# EAGLE design TopBoardLidar (EAGLE 9.4.2)
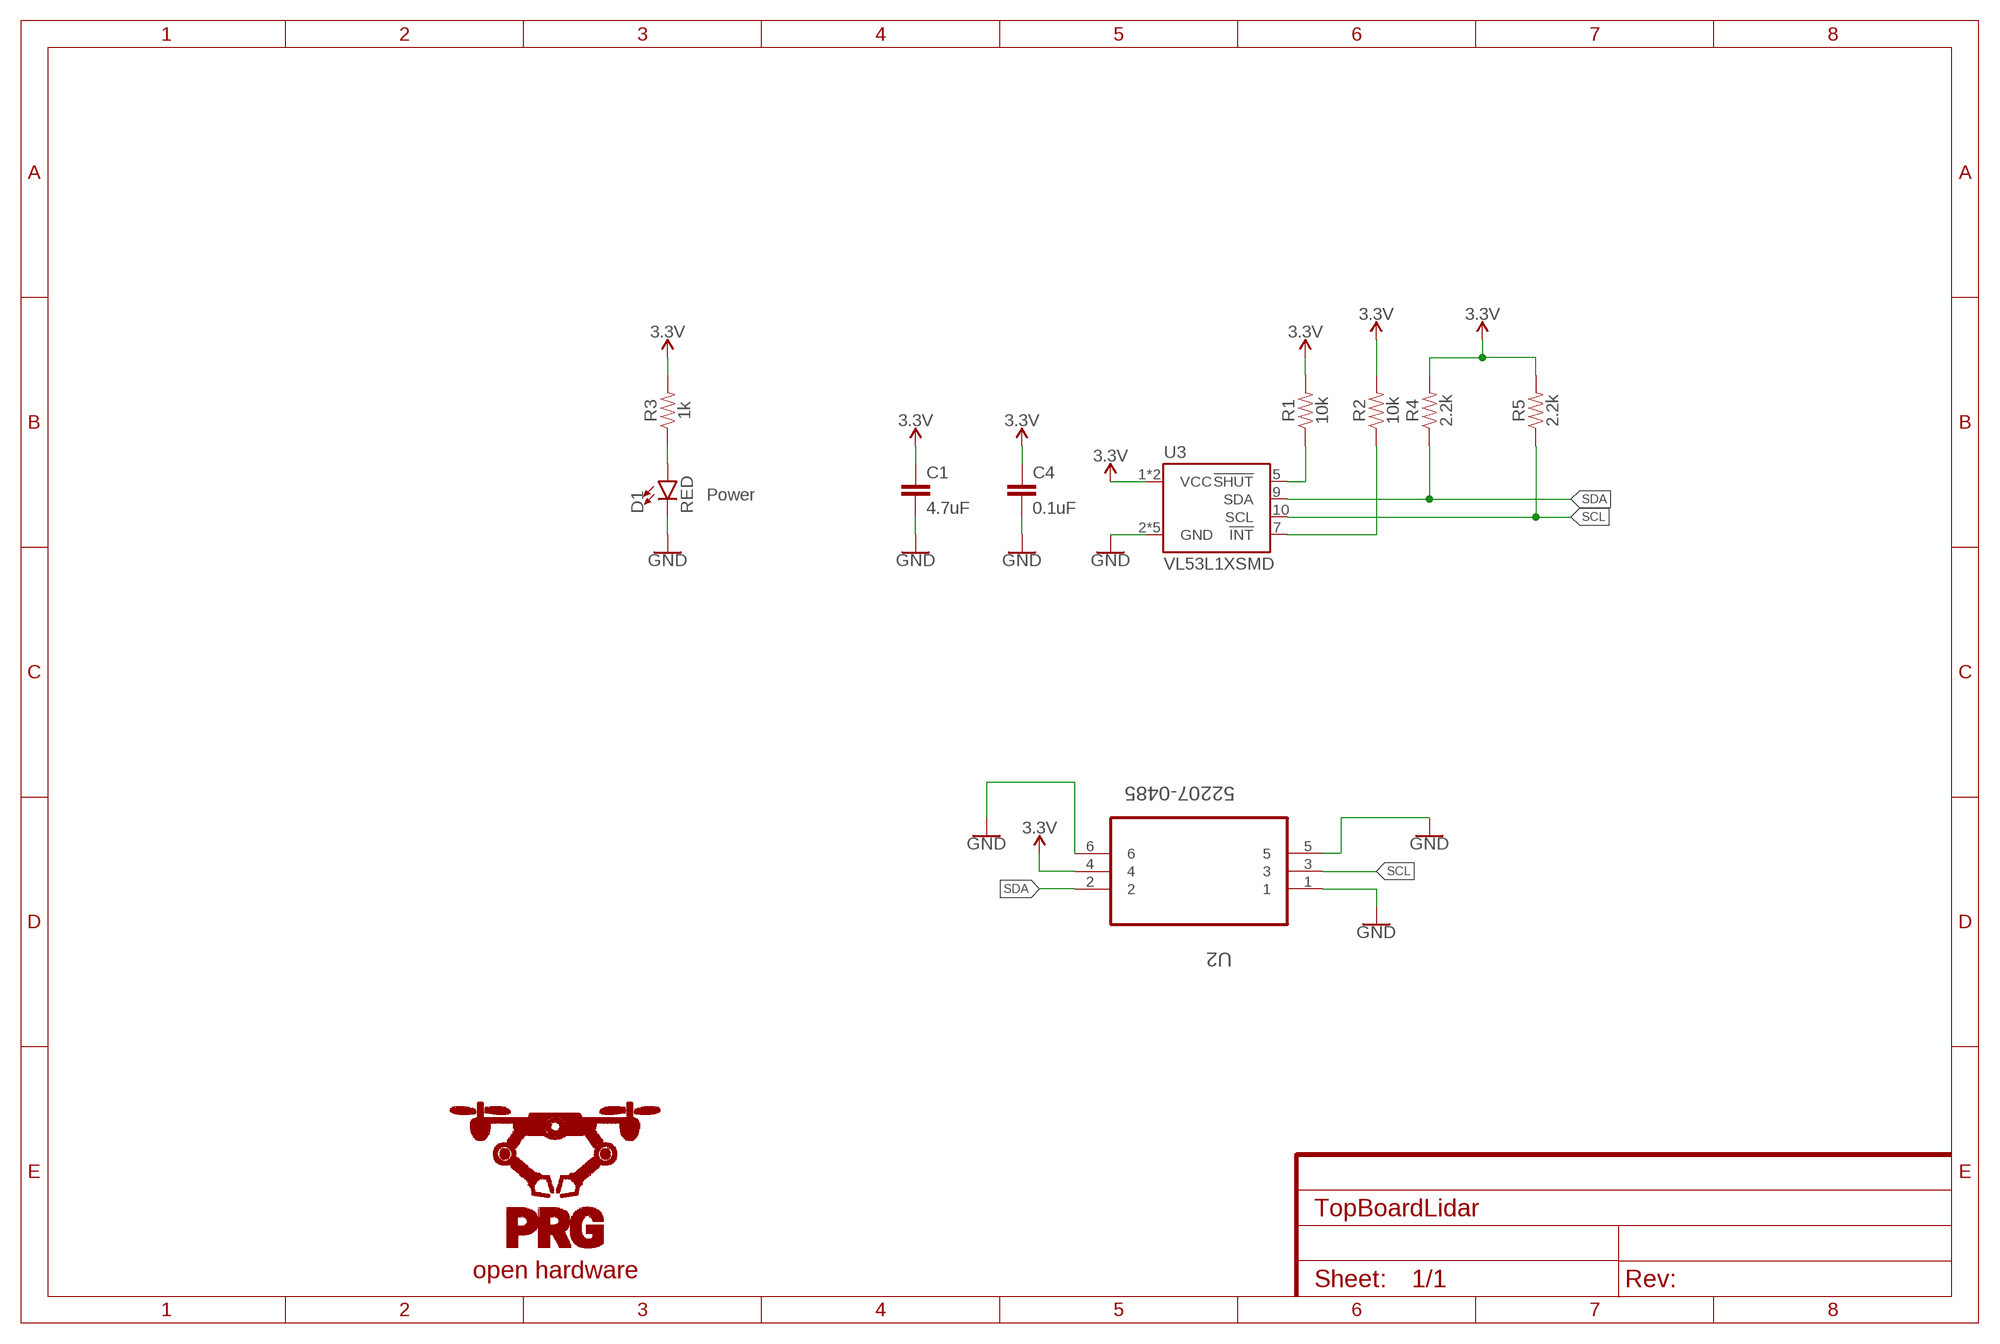
[diagram p0: schematic, sheet 1]

## Parts
C1  4.7uF  4.7UF0603  [0603]
C4  0.1uF  0.1UF-0603-25V-(+80/-20%)  [0603]
D1  RED  LED-RED0603  [LED-0603]
R1  10k  10KOHM-0603-1/10W-1%  [0603]
R2  10k  10KOHM-0603-1/10W-1%  [0603]
R3  1k  1KOHM-0603-1/10W-1%  [0603]
R4  2.2k  2.2KOHM-0402T-1/16W-1%  [0402-TIGHT]
R5  2.2k  2.2KOHM-0402T-1/16W-1%  [0402-TIGHT]
U2  52207-0485  [MOLEX_52207-0485]
U3  VL53L1XSMD  [VL53L1X]

## Nets
3.3V: C1.1 C4.1 R1.2 R2.2 R3.2 R4.2 R5.2 U2.4 U3.1(VCC) U3.11(VCC)
GND: C1.2 C4.2 D1.C U2.1 U2.5 U2.6 U3.2(GND) U3.3(GND) U3.4(GND) U3.6(GND) U3.12(GND)
N$1: R1.1 U3.5(!SHUT)
N$3: D1.A R3.1
N$8: R2.1 U3.7(!INT)
SCL: R5.1 U2.3 U3.10(SCL)
SDA: R4.1 U2.2 U3.9(SDA)

## Notes on the sheet
- Power
- open hardware

## Library data of the parts
C1 = SparkFun-Capacitors:4.7UF: 4.7µF ceramic capacitors A capacitor is a passive two-terminal electrical component used to store electrical energy temporarily in an electric field.; PROD_ID: CAP-08280
C4 = SparkFun-Capacitors:0.1UF: 0.1µF ceramic capacitors A capacitor is a passive two-terminal electrical component used to store electrical energy temporarily in an electric field.; PROD_ID: CAP-00810
D1 = SparkFun-LED:LED-RED: Red SMD LED Used in manufacturing of most products at SparkFun Packages: 0603 - SMD 0603 package [Product Link] <http://docs.avagotech.com/docs/AV02-0551EN> 0603 SMART - SMD 0603 SMART package ( more efficient and expensive)[Product Link] <http://www.osram-os.com/Graphics/XPic2/00077099_0.pdf> 1206 - SMD1206 package [Product Link] <https://www.sparkfun.com/datasheets/DevTools/LilyPad/Q150OVS4.pdff> SparkFun Products: Pro Mini 328 -5V <https://www.sparkfun.com/products/821> RedBoard <https://www.sparkfun.com/products/12757> IOIO-OTG <https://www.sparkfun.com/products/13613>; PROD_ID: DIO-00819
R1 R2 = SparkFun-Resistors:10KOHM: 10kΩ resistor A resistor is a passive two-terminal electrical component that implements electrical resistance as a circuit element. Resistors act to reduce current flow, and, at the same time, act to lower voltage levels within circuits. - Wikipedia; PROD_ID: RES-00824
R3 = SparkFun-Resistors:1KOHM: 1kΩ resistor A resistor is a passive two-terminal electrical component that implements electrical resistance as a circuit element. Resistors act to reduce current flow, and, at the same time, act to lower voltage levels within circuits. - Wikipedia; PROD_ID: RES-07856
R4 R5 = SparkFun-Resistors:2.2KOHM: 2.2kΩ resistor A resistor is a passive two-terminal electrical component that implements electrical resistance as a circuit element. Resistors act to reduce current flow, and, at the same time, act to lower voltage levels within circuits. - Wikipedia; PROD_ID: RES-14341
U2 = Molex_By_element14_Batch_1:52207-0485: SOCKET FPC, SMT, 1MM, 4 WAY; MPN: 52207-0485; OC_FARNELL: 1463013; OC_NEWARK: 58J9499; PACKAGE: SOCKET FPC, SMT, 1MM, 4 WAY; SUPPLIER: Molex
U3 = vl53l1x:VL53L1X

## Board
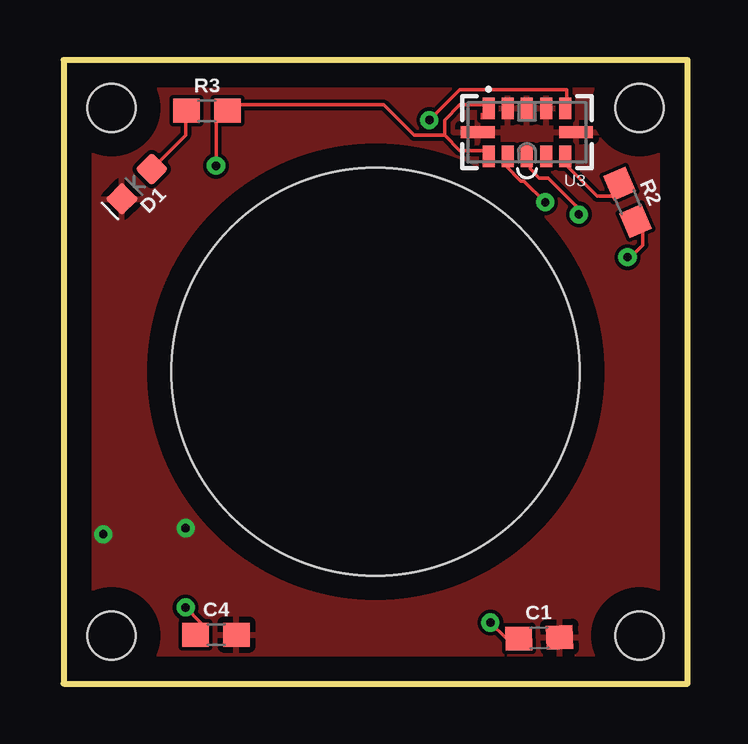
[diagram p1: board, top side]
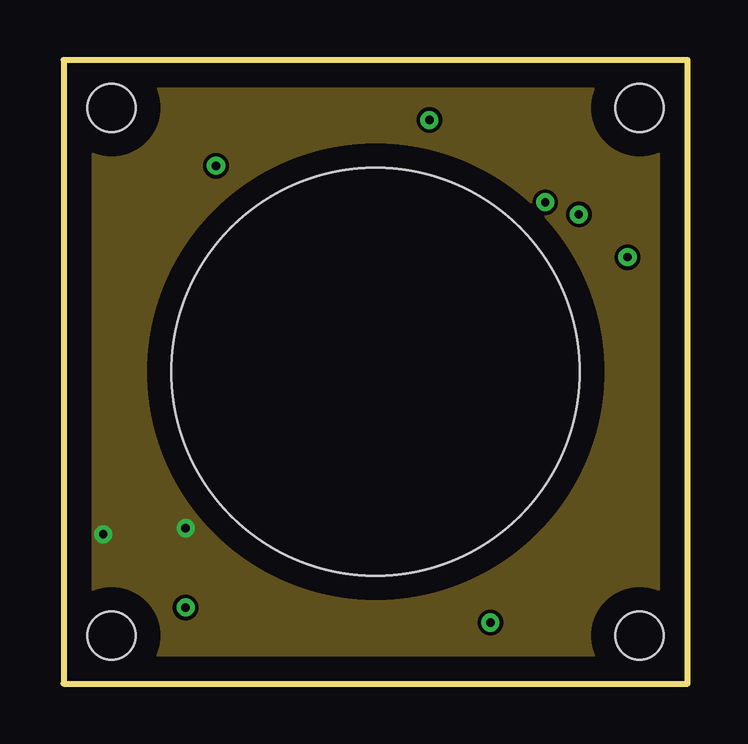
[diagram p2: board, inner layer Route2]
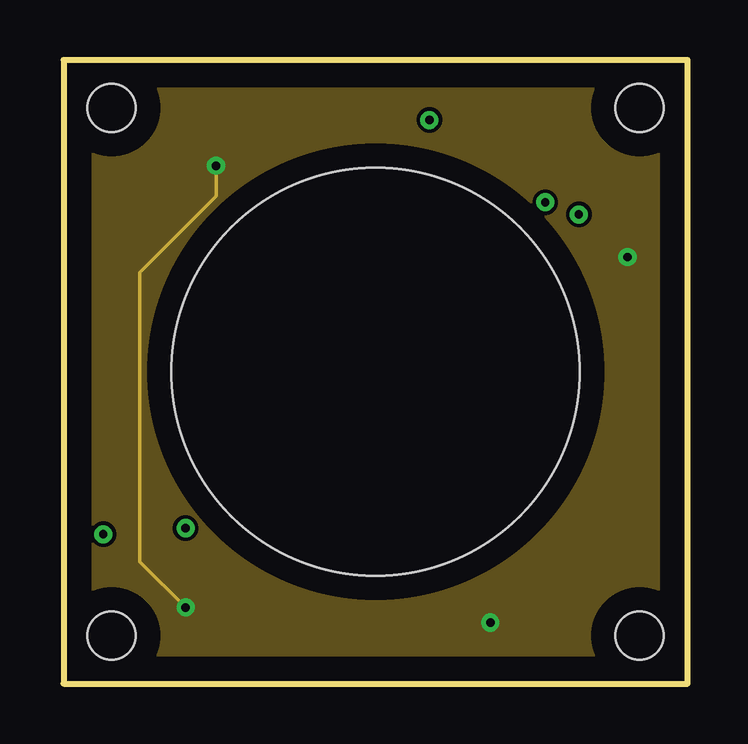
[diagram p3: board, inner layer Route15]
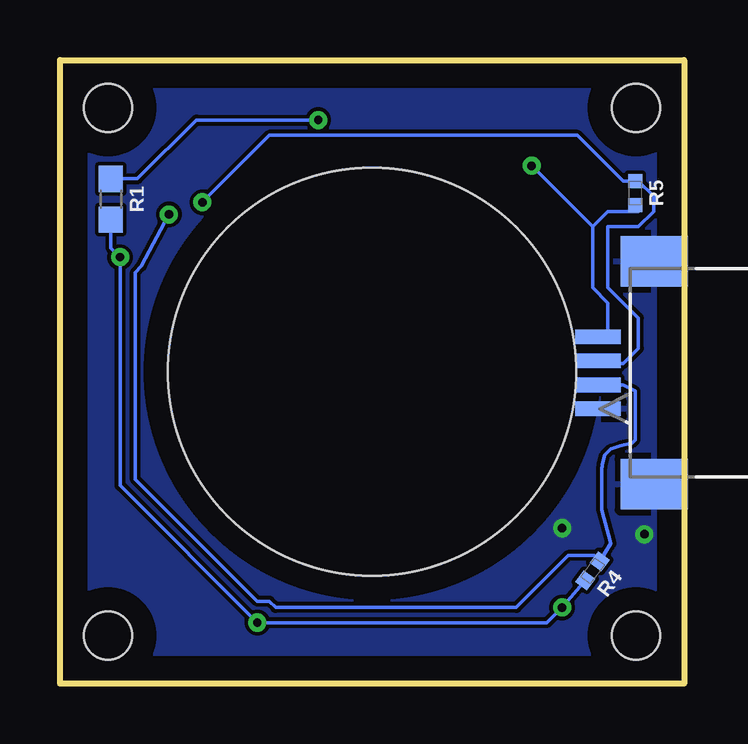
[diagram p4: board, bottom side, seen from below]

Size 26 x 26 mm. Coordinates in mm from the lower left corner, seen from the top.
Outline: 0,26 0,0 26,0 26,26 0,26
Copper layers (1+2*15+16): Top 0.035mm / dielectric 0.18mm / Route2 0.017mm / dielectric 1.12mm / Route15 0.017mm / dielectric 0.18mm / Bottom 0.035mm
Design rules "default *": minimum track width 6mil, minimum drill 0.35mm, track to track 6mil, track to pad 6mil, pad to pad 6mil, via to via 6mil, smd to smd 6mil, copper to edge 40mil, drill to drill 6mil, minimum pad ring 10mil, minimum via ring 8mil, stop-mask expansion 4mil, vias tented up to drill 0mil, thermal gap 10mil
Holes 17 mm at 13,13
Holes 2 mm at 24,2 24,24 2,24 2,2

### Footprints (pad centres in the part's own frame; a part is rotated, then mirrored left to right if it is on the bottom)
0603 = smd 1.1 x 1: 1 -0.85,0; 2 0.85,0
LED-0603 = smd 1 x 1: A -0.877,0; C 0.877,0
0402-TIGHT = smd 0.6 x 0.6: 1 -0.5,0; 2 0.5,0
MOLEX_52207-0485 = smd 0.61 x 1.905: 1 1.499,4.801; 2 0.508,4.801; 3 -0.508,4.801; 4 -1.499,4.801 | smd 2.108 x 2.794: 5 -4.648,7.137; 6 4.648,7.137
VL53L1X = smd 0.5 x 0.9: 1 1.6,-1; 2 0.8,-1; 3 0,-1; 4 -0.8,-1; 5 -1.6,-1; 7 -1.6,1; 8 -0.8,1; 9 0,1; 10 0.8,1; 11 1.6,1 | smd 1.4 x 0.5: 6 -2.05,0; 12 2.05,0

### Placement (x,y rotation side)
C1  19.81,1.91 1.8 top
C4  6.35,2.03 0 top
D1  3.05,20.83 225 top
R1  23.88,20.19 270 bottom
R2  23.5,20.07 293.2 top
R3  5.97,23.88 0 top
R4  3.81,4.7 233.2 bottom
R5  2.03,20.45 270 bottom
U2  8.38,12.95 270 bottom
U3  19.3,22.99 180 top

### Tracks (layer width: path | path; a pad name or v marks a point on that pad's centre or on a via)
3.3V  (via drill 0.35)
  Top 0.152: 15.88,22.86 16.51,22.23 17.78,22.23 U3.11 | 15.88,22.86 15.88,23.5 16.51,24.13 17.58,24.13 17.57,24.12 U3.1 | v6.35,21.59 6.35,23.5 R3.2 6.99,24.13 13.34,24.13 14.61,22.86 15.88,22.86 | v5.08,3.17 5.71,2.54 5.71,1.91 C4.1 | v17.78,2.54 18.41,1.91 C1.1 | v23.5,17.78 23.62,17.78 24.13,18.29 24.13,19.05 R2.2
  Route15 0.152: v6.35,21.59 6.35,20.32 3.17,17.14 3.17,5.08 v5.08,3.17
  Bottom 0.152: 3.81,19.05 3.17,19.68 1.91,19.68 R5.2 | 3.81,19.05 3.81,16.51 3.17,15.88 3.17,14.61 U2.4 | 3.81,19.05 v6.35,21.59 | 24.13,18.92 R1.2 23.88,18.16 v23.5,17.78 23.5,8.26 v17.78,2.54 5.71,2.54 v5.08,3.17 R4.2
  pour Route15: -2.54,29.21 -2.54,-2.54 27.94,-2.54 27.94,29.21
GND  (via drill 0.35)
  other vias: 1.65,6.22 5.08,6.48
  pour Route2: -1.27,27.94 -1.27,-1.27 26.67,-1.27 26.67,26.67 0,26.67
  pour Top: -3.56,30.35 -3.56,-3.68 -3.43,-3.81 29.08,-3.81 29.21,-3.68 29.21,30.48 28.96,30.73 -3.17,30.73
  pour Bottom: -4.19,30.1 -4.19,-3.68 -3.94,-3.94 28.57,-3.94 29.72,-2.79 29.97,-2.54 29.97,30.35 -3.94,30.35
N$1  (via drill 0.35)
  Top 0.152: v15.24,23.5 16.51,24.77 20.95,24.77 20.95,24.13 U3.5
  Bottom 0.152: v15.24,23.5 20.32,23.5 22.77,21.04 R1.1
N$3
  Top 0.152: D1.A 5.08,22.86 5.08,23.5 R3.1
N$8
  Top 0.152: U3.7 20.95,21.59 22.23,20.32 22.86,20.32 R2.1
SCL  (via drill 0.35)
  Top 0.152: U3.10 18.41,21.59 19.05,20.95 19.18,20.95 v20.07,20.07
  Bottom 0.152: 1.91,20.95 1.27,20.32 1.27,19.68 1.91,19.05 3.17,19.05 3.17,16.51 1.91,15.24 1.91,13.97 2.54,13.34 3.17,13.34 U2.3 | 1.91,20.95 2.54,20.95 4.45,22.86 17.27,22.86 v20.07,20.07 | 1.91,20.95 R5.1
SDA  (via drill 0.35)
  Top 0.152: U3.9 19.43,21.86 19.43,21.46 19.81,21.08 20.19,21.08 21.46,19.81 v21.46,19.56
  Bottom 0.152: U2.2 2.54,12.45 2.03,12.19 2.03,10.16 2.16,10.03 2.67,9.91 3.05,9.78 3.3,9.53 3.41,9.14 3.41,9.03 3.43,9.01 3.43,7.24 3.05,5.84 R4.1 3.75,5.33 4.83,5.33 6.99,3.17 17.02,3.17 17.27,3.43 17.78,3.43 22.86,8.51 22.86,17.14 22.61,17.4 v21.46,19.56